# EAGLE design hexa2wide (EAGLE 7.2.0)
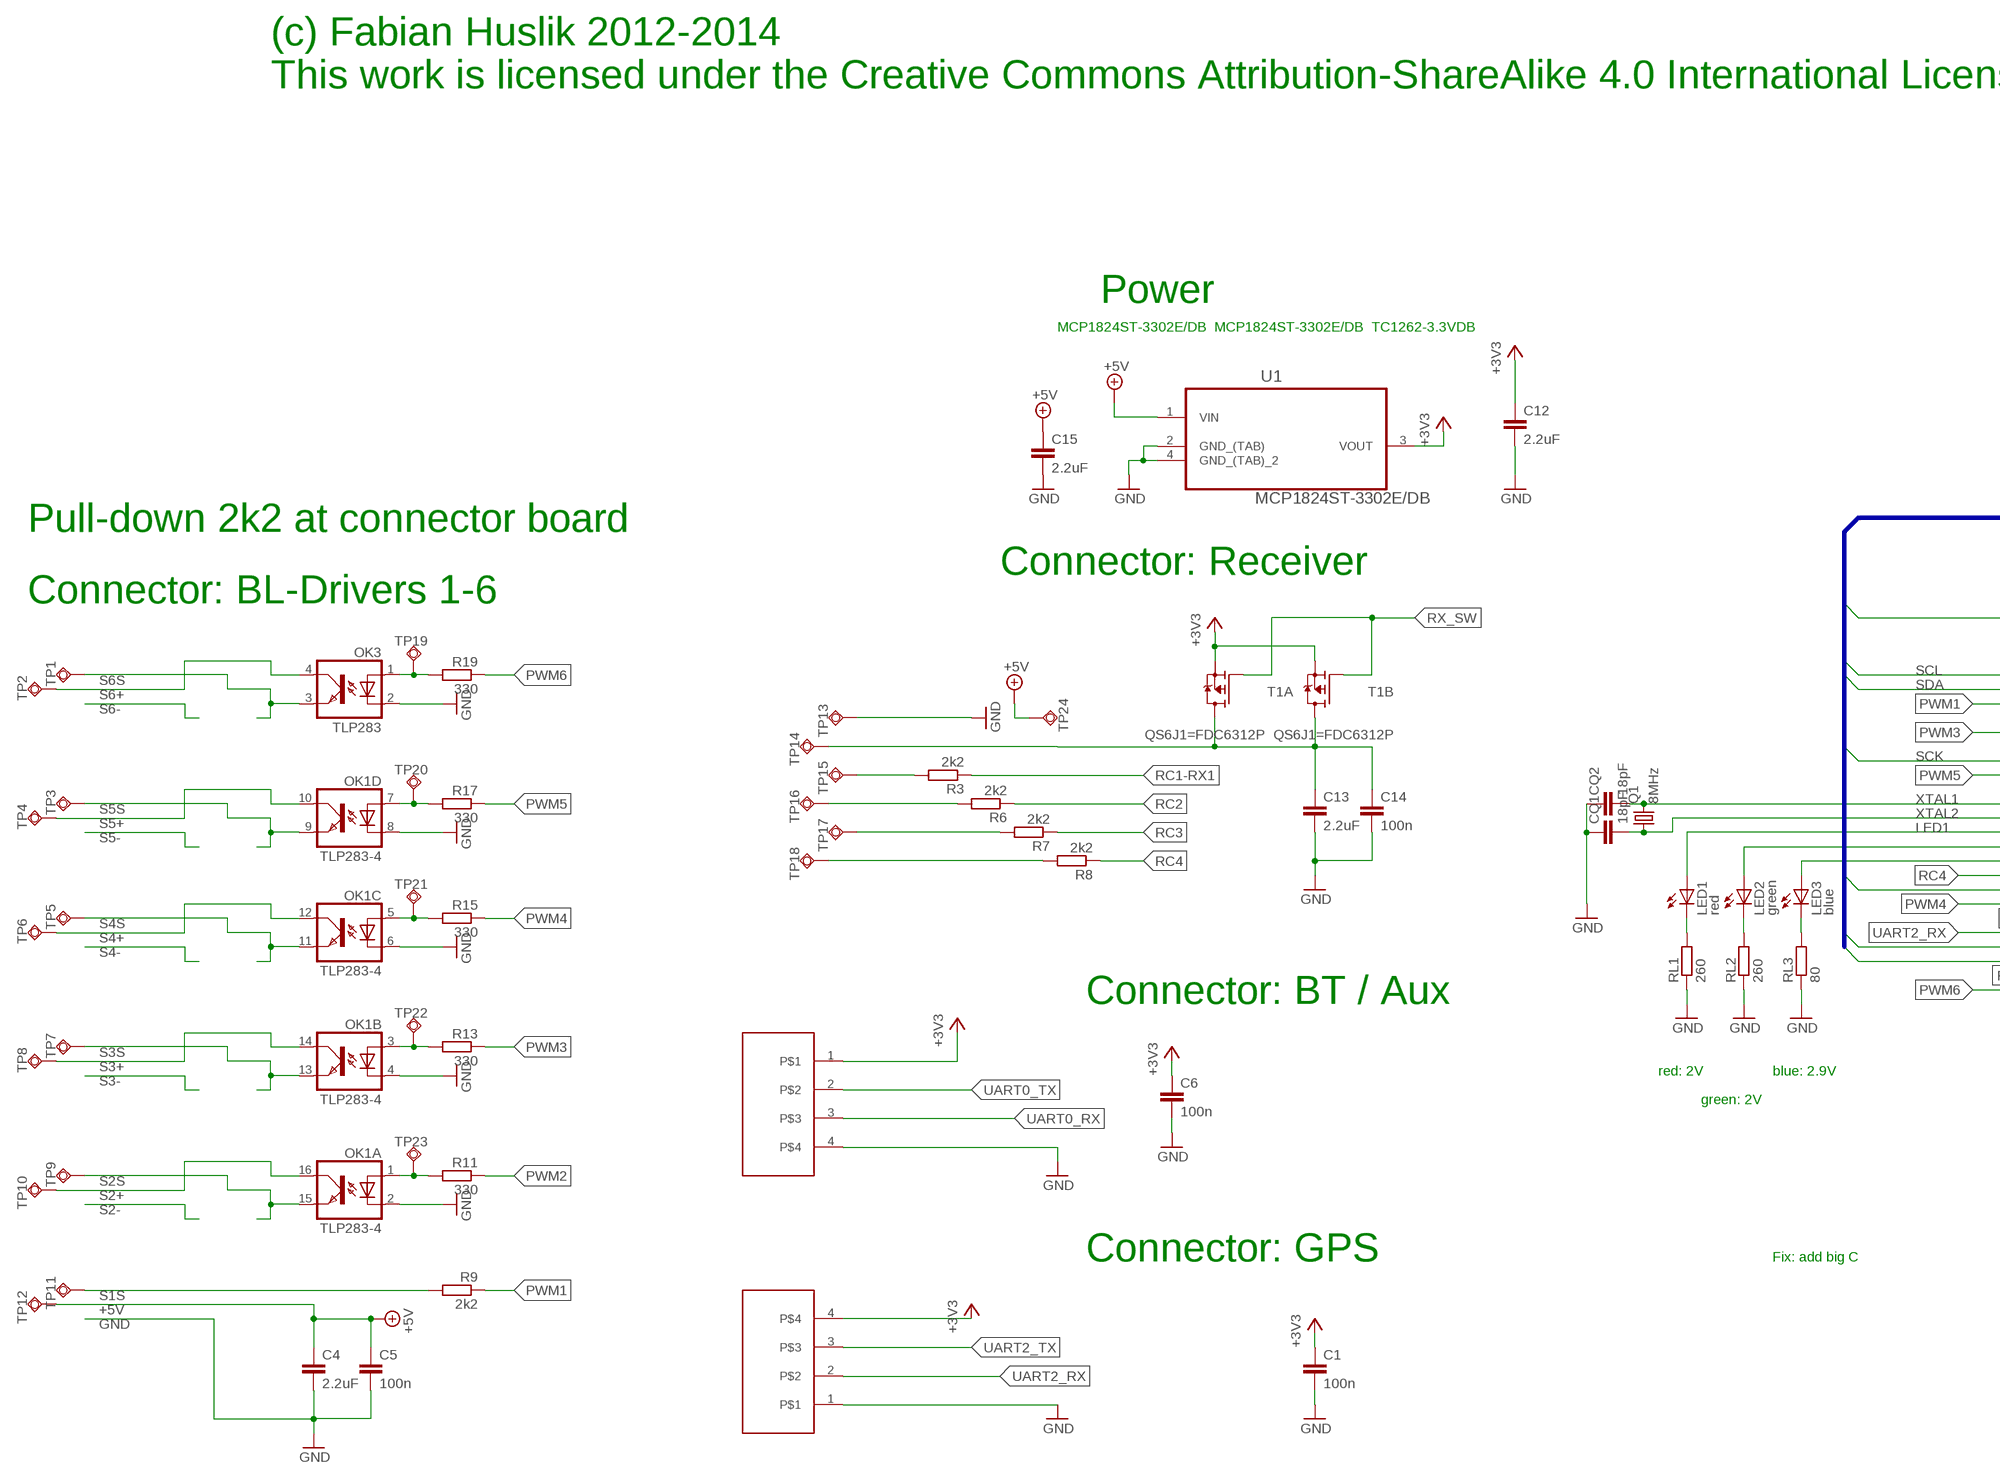
[diagram p0: schematic, sheet 1, part 1 of 2]
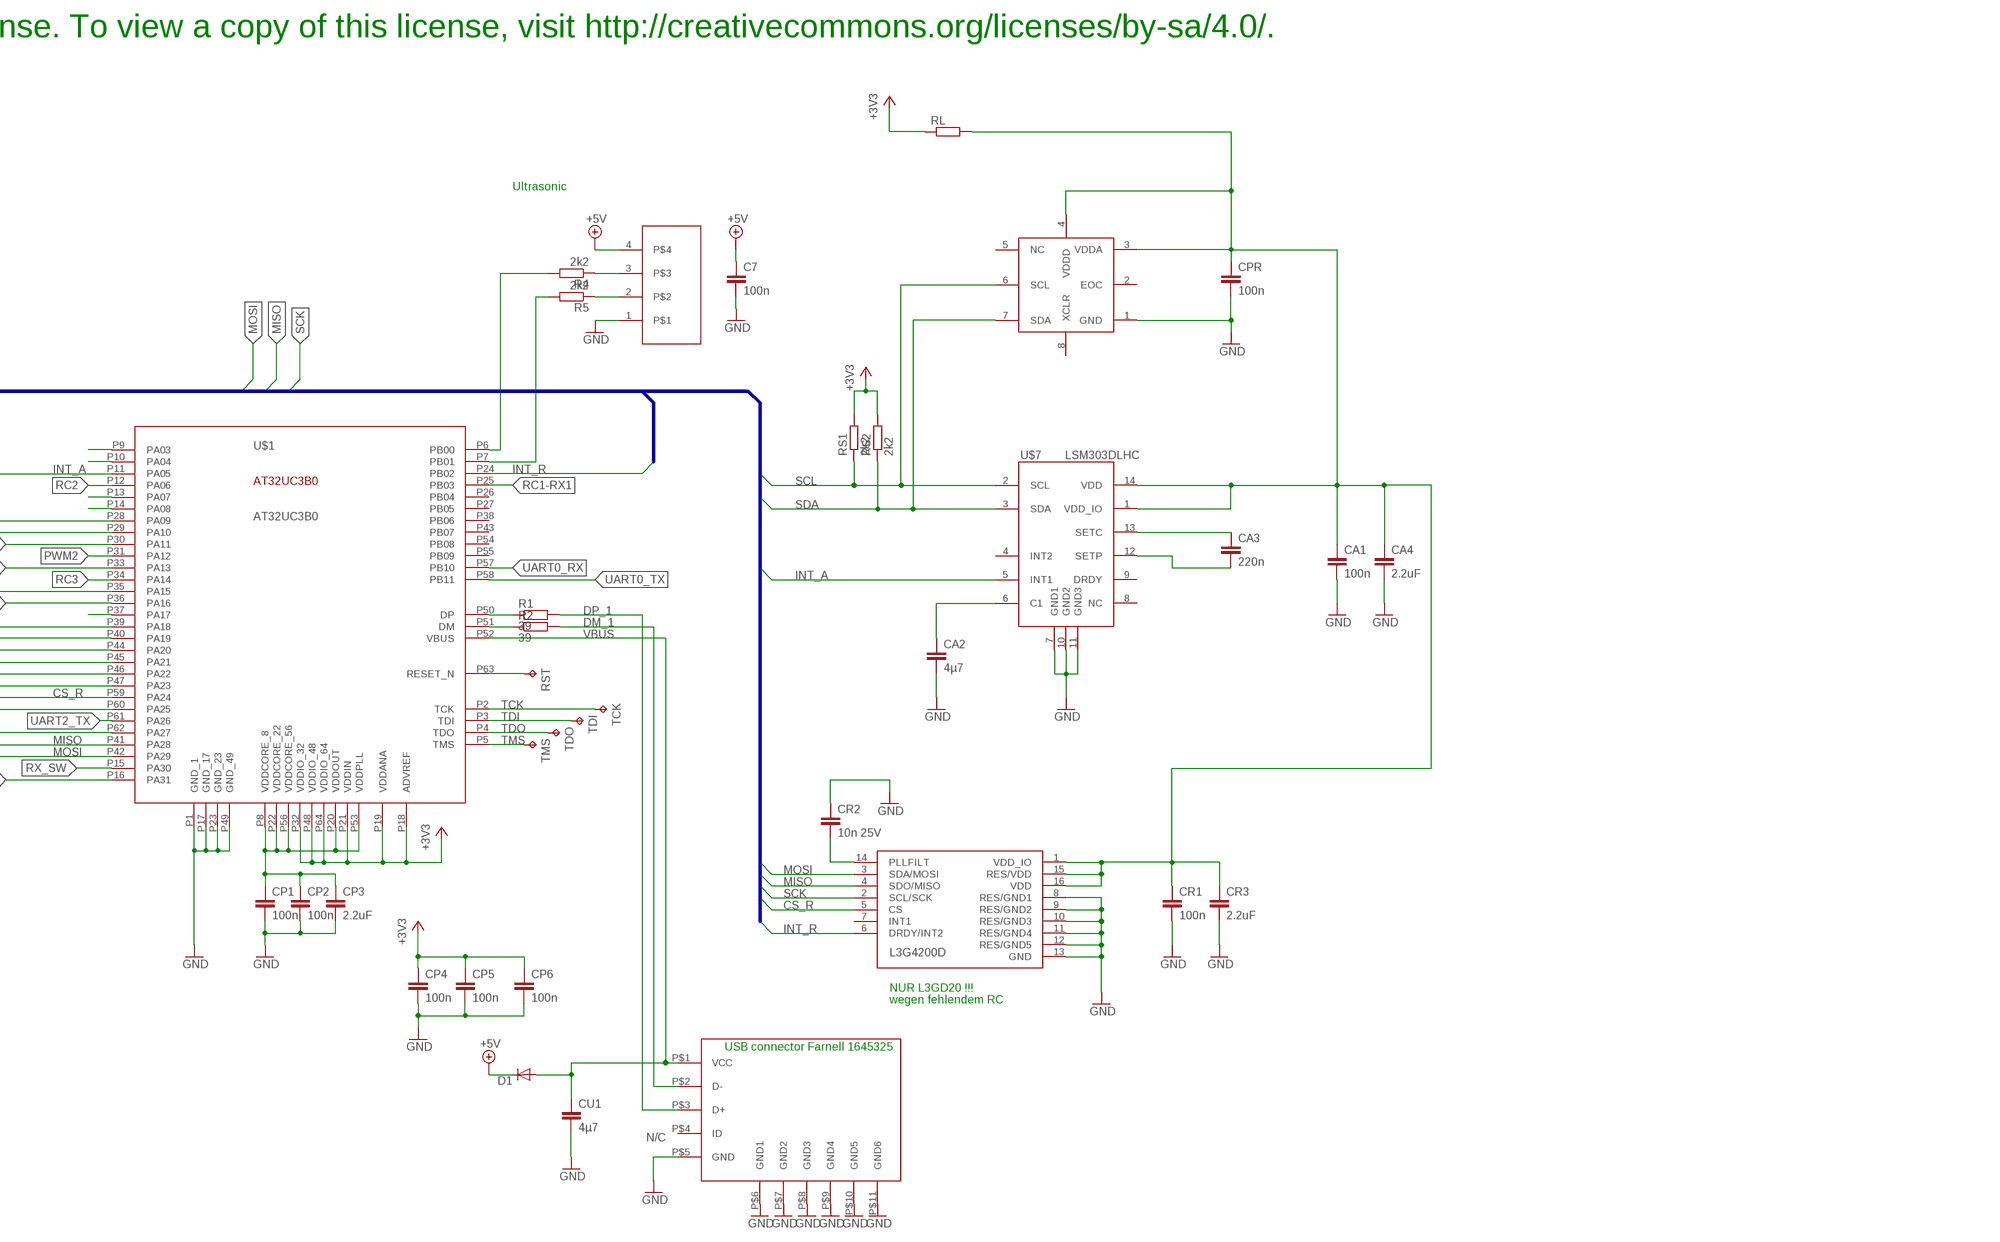
[diagram p1: schematic, sheet 1, part 2 of 2]

## Parts
C1  100n  C-EUC0402  [C0402]
C4  2.2uF  C-EUC0603K  [C0603K]
C5  100n  C-EUC0402  [C0402]
C6  100n  C-EUC0402  [C0402]
C7  100n  C-EUC0402  [C0402]
C12  2.2uF  C-EUC0603K  [C0603K]
C13  2.2uF  C-EUC0603K  [C0603K]
C14  100n  C-EUC0402  [C0402]
C15  2.2uF  C-EUC0603K  [C0603K]
CA1  100n  C-EUC0402  [C0402]
CA2  4µ7  C-EUC0805  [C0805]
CA3  220n  C-EUC0402  [C0402]
CA4  2.2uF  C-EUC0603K  [C0603K]
CP1  100n  C-EUC0402  [C0402]
CP2  100n  C-EUC0402  [C0402]
CP3  2.2uF  C-EUC0603K  [C0603K]
CP4  100n  C-EUC0402  [C0402]
CP5  100n  C-EUC0402  [C0402]
CP6  100n  C-EUC0402  [C0402]
CPR  100n  C-EUC0402  [C0402]
CQ1  18pF  C-EUC0402  [C0402]
CQ2  18pF  C-EUC0402  [C0402]
CR1  100n  C-EUC0402  [C0402]
CR2  10n 25V  C-EUC0402  [C0402]
CR3  2.2uF  C-EUC0603K  [C0603K]
CU1  4µ7  C-EUC0805  [C0805]
D1  DIODE-MICROMELF-R  [MICROMELF-R]
LED1  red  LEDCHIP-LED0603  [CHIP-LED0603]
LED2  green  LEDCHIP-LED0603  [CHIP-LED0603]
LED3  blue  LEDCHIP-LED0603  [CHIP-LED0603]
OK1  TLP283-4  [MINI-FLAT-16]
OK3  TLP283  [MINI-FLAT-4]
Q1  8MHz  CRYSTALCTS406  [CTS406]
R1  39  R-EU_R0402  [R0402]
R2  39  R-EU_R0402  [R0402]
R3  2k2  R-EU_R0402  [R0402]
R4  2k2  R-EU_R0402  [R0402]
R5  2k2  R-EU_R0402  [R0402]
R6  2k2  R-EU_R0402  [R0402]
R7  2k2  R-EU_R0402  [R0402]
R8  2k2  R-EU_R0402  [R0402]
R9  2k2  R-EU_R0402  [R0402]
R11  330  R-EU_R0402  [R0402]
R13  330  R-EU_R0402  [R0402]
R15  330  R-EU_R0402  [R0402]
R17  330  R-EU_R0402  [R0402]
R19  330  R-EU_R0402  [R0402]
RL  R-EU_R0603  [R0603]
RL1  260  R-EU_R0402  [R0402]
RL2  260  R-EU_R0402  [R0402]
RL3  80  R-EU_R0402  [R0402]
RS1  2k2  R-EU_R0402  [R0402]
RS2  2k2  R-EU_R0402  [R0402]
RST  TPB1,27  [B1,27]
T1  QS6J1=FDC6312P  [SUPERSOT-6]
TCK  TPB1,27  [B1,27]
TDI  TPB1,27  [B1,27]
TDO  TPB1,27  [B1,27]
TMS  TPB1,27  [B1,27]
TP1  TPSQTP16SQ  [TP16SQ]
TP2  TPSQTP16SQ  [TP16SQ]
TP3  TPSQTP16SQ  [TP16SQ]
TP4  TPSQTP16SQ  [TP16SQ]
TP5  TPSQTP16SQ  [TP16SQ]
TP6  TPSQTP16SQ  [TP16SQ]
TP7  TPSQTP16SQ  [TP16SQ]
TP8  TPSQTP16SQ  [TP16SQ]
TP9  TPSQTP16SQ  [TP16SQ]
TP10  TPSQTP16SQ  [TP16SQ]
TP11  TPSQTP16SQ  [TP16SQ]
TP12  TPSQTP16SQ  [TP16SQ]
TP13  TPSQTP16SQ  [TP16SQ]
TP14  TPSQTP16SQ  [TP16SQ]
TP15  TPSQTP16SQ  [TP16SQ]
TP16  TPSQTP16SQ  [TP16SQ]
TP17  TPSQTP16SQ  [TP16SQ]
TP18  TPSQTP16SQ  [TP16SQ]
TP19  TPSQTP10SQ  [TP10SQ]
TP20  TPSQTP10SQ  [TP10SQ]
TP21  TPSQTP10SQ  [TP10SQ]
TP22  TPSQTP10SQ  [TP10SQ]
TP23  TPSQTP10SQ  [TP10SQ]
TP24  TPSQTP10SQ  [TP10SQ]
U1  MCP1824ST-3302E/DB  [SOT230P700X180-4N]
U$1  AT32UC3B0  [JEDEC_MS-026]
U$4  UBB_MICRO_HIROSE  [USB_MICRO]
U$5  L3G4200DHAND  [LGA16_HAND]
U$7  LSM303HAND  [LGA14_HAND]
U$9  BMP085  [BMP085]
U$10  4WIRE_CONN  [4WIRE_PIN]
U$11  4WIRE_CONN  [4WIRE_PIN]
U$12  4WIRE_CONN  [4WIRE_PIN]

## Nets
1V6: CP1.1 CP2.1 CP3.1 U$1.P8(VDDCORE_8) U$1.P20(VDDOUT) U$1.P22(VDDCORE_22) U$1.P53(VDDPLL) U$1.P56(VDDCORE_56)
+3V3 [power]: C1.1 C6.1 C12.1 CP4.1 CP5.1 CP6.1 RL.1 RS1.2 RS2.2 T1.P$2(B:S) T1.P$5(A:S) U1.3(VOUT) U$1.P18(ADVREF) U$1.P19(VDDANA) U$1.P21(VDDIN) U$1.P32(VDDIO_32) U$1.P48(VDDIO_48) U$1.P64(VDDIO_64) U$10.4 U$11.1
+5V [power]: C4.1 C5.1 C7.1 C15.1 D1.C TP12.TP TP24.TP U1.1(VIN) U$12.4
CS_R: U$1.P59(PA24) U$5.5(CS)
DM: R2.1 U$1.P51(DM)
DM_1: R2.2 U$4.P$2(D-)
DP: R1.1 U$1.P50(DP)
DP_1: R1.2 U$4.P$3(D+)
GND [power]: C1.2 C4.2 C5.2 C6.2 C7.2 C12.2 C13.2 C14.2 C15.2 CA1.2 CA2.2 CA4.2 CP1.2 CP2.2 CP3.2 CP4.2 CP5.2 CP6.2 CPR.2 CQ1.1 CQ2.1 CR1.2 CR2.1 CR3.2 CU1.2 OK1.2(A:C) OK1.4(B:C) OK1.6(C:C) OK1.8(D:C) OK3.2(C) RL1.1 RL2.1 RL3.1 TP13.TP U1.2(GND_(TAB)) U1.4(GND_(TAB)_2) U$1.P1(GND_1) U$1.P17(GND_17) U$1.P23(GND_23) U$1.P49(GND_49) U$4.P$5(GND) U$4.P$6(GND1) U$4.P$7(GND2) U$4.P$8(GND3) U$4.P$9(GND4) U$4.P$10(GND5) U$4.P$11(GND6) U$5.8(RES/GND1) U$5.9(RES/GND2) U$5.10(RES/GND3) U$5.11(RES/GND4) U$5.12(RES/GND5) U$5.13(GND) U$7.7(GND1) U$7.10(GND2) U$7.11(GND3) U$9.1(GND) U$10.1 U$11.4 U$12.1
INT_A: U$1.P11(PA05) U$7.5(INT1)
INT_R: U$1.P24(PB02) U$5.6(DRDY/INT2)
LED1: LED1.A U$1.P44(PA20)
MISO: U$1.P41(PA28) U$5.4(SDO/MISO)
MOSI: U$1.P42(PA29) U$5.3(SDA/MOSI)
N$1: LED1.C RL1.2
N$2: RST.TP U$1.P63(RESET_N)
N$3: CA3.1 U$7.13(SETC)
N$4: LED2.C RL2.2
N$5: LED3.C RL3.2
N$6: LED2.A U$1.P45(PA21)
N$7: LED3.A U$1.P46(PA22)
N$8: CR2.2 U$5.14(PLLFILT)
N$9: U$1.P9(PA03)
N$10: CA2.1 U$7.6(C1)
N$11: CA3.2 U$7.12(SETP)
N$12: R3.2 TP15.TP
N$13 [power]: C13.1 C14.1 T1.P$4(B:D) T1.P$6(A:D) TP14.TP
N$14: R6.2 TP16.TP
N$15: R7.2 TP17.TP
N$16: R8.2 TP18.TP
N$17: U$1.P10(PA04)
N$18: OK1.1(A:A) R11.2 TP23.TP
N$19: OK1.3(B:A) R13.2 TP22.TP
N$20: U$1.P13(PA07)
N$21: U$1.P14(PA08)
N$22: OK1.5(C:A) R15.2 TP21.TP
N$23: R4.1 U$12.3
N$24: U$1.P37(PA17)
N$25: R5.1 U$12.2
N$26: OK1.7(D:A) R17.2 TP20.TP
N$30: OK3.1(A) R19.2 TP19.TP
PWM1: R9.1 U$1.P30(PA11)
PWM2: R11.1 U$1.P31(PA12)
PWM3: R13.1 U$1.P33(PA13)
PWM4: R15.1 U$1.P60(PA25)
PWM5: R17.1 U$1.P36(PA16)
PWM6: R19.1 U$1.P16(PA31)
RC1-RX1: R3.1 U$1.P25(PB03)
RC2: R6.1 U$1.P12(PA06)
RC3: R7.1 U$1.P34(PA14)
RC4: R8.1 U$1.P47(PA23)
RX_SW: T1.P$1(A:G) T1.P$3(B:G) U$1.P15(PA30)
S1S: R9.2 TP11.TP
S2+: OK1.16(A:COL) TP10.TP
S2S: OK1.15(A:EMIT) TP9.TP
S3+: OK1.14(B:COL) TP8.TP
S3S: OK1.13(B:EMIT) TP7.TP
S4+: OK1.12(C:COL) TP6.TP
S4S: OK1.11(C:EMIT) TP5.TP
S5+: OK1.10(D:COL) TP4.TP
S5S: OK1.9(D:EMIT) TP3.TP
S6+: OK3.4(COL) TP2.TP
S6S: OK3.3(EMIT) TP1.TP
SCK: U$1.P35(PA15) U$5.2(SCL/SCK)
SCL: RS1.1 U$1.P28(PA09) U$7.2(SCL) U$9.6(SCL)
SDA: RS2.1 U$1.P29(PA10) U$7.3(SDA) U$9.7(SDA)
TCA0: R4.2 U$1.P6(PB00)
TCB0: R5.2 U$1.P7(PB01)
TCK: TCK.TP U$1.P2(TCK)
TDI: TDI.TP U$1.P3(TDI)
TDO: TDO.TP U$1.P4(TDO)
TMS: TMS.TP U$1.P5(TMS)
UART0_RX: U$1.P57(PB10) U$11.3
UART0_TX: U$1.P58(PB11) U$11.2
UART2_RX: U$1.P62(PA27) U$10.2
UART2_TX: U$1.P61(PA26) U$10.3
VBUS: CU1.1 D1.A U$1.P52(VBUS) U$4.P$1(VCC)
VCCSENS [power]: CA1.1 CA4.1 CPR.1 CR1.1 CR3.1 RL.2 U$5.1(VDD_IO) U$5.15(RES/VDD) U$5.16(VDD) U$7.1(VDD_IO) U$7.14(VDD) U$9.3(VDDA) U$9.4(VDDD)
XTAL1: CQ2.2 Q1.3 U$1.P39(PA18)
XTAL2: CQ1.2 Q1.1 U$1.P40(PA19)
Unconnected: U$1.P26(PB04) U$1.P27(PB05) U$1.P38(PB06) U$1.P43(PB07) U$1.P54(PB08) U$1.P55(PB09) U$4.P$4(ID) U$5.7(INT1) U$7.4(INT2) U$7.8(NC) U$7.9(DRDY) U$9.2(EOC) U$9.5(NC) U$9.8(XCLR)

## Buses
MOSI,MISO,SCK,CS_R,INT_R,INT_A,SCL,SDA

## Notes on the sheet
- (c) Fabian Huslik 2012-2014
- This work is licensed under the Creative Commons Attribution-ShareAlike 4.0 International License. To view a copy of this license, visit http://creativecommons.org/licenses/by-sa/4.0/.
- Ultrasonic
- Power
- MCP1824ST-3302E/DB  MCP1824ST-3302E/DB  TC1262-3.3VDB
- Pull-down 2k2 at connector board
- Connector: Receiver
- Connector: BL-Drivers 1-6
- Connector: BT / Aux
- red: 2V | blue: 2.9V
- green: 2V
- NUR L3GD20 !!!
- Connector: GPS | Fix: add big C | wegen fehlendem RC
- USB connector Farnell 1645325
- N/C

## Library data of the parts
C1 C5-C7 C14 CA1 CP1 CP2 CP4-CP6 CPR CR1 = rcl:C-EU: CAPACITOR, European symbol; MF: MULTICOMP; MPN: MCCA000050; OC_FARNELL: 1758896
C4 C12 C13 C15 CA4 CP3 CR3 = rcl:C-EU: CAPACITOR, European symbol; MF: MURATA; MPN: GRM188R61C225KE15D; OC_FARNELL: 1735526
CA2 CU1 = rcl:C-EU: CAPACITOR, European symbol; MF: MURATA; MPN: GRM219R61C475KE15D; OC_FARNELL: 1845746
CA3 = rcl:C-EU: CAPACITOR, European symbol; MF: KEMET; MPN: C0402C224K9PACTU; OC_FARNELL: 1572610
CQ1 CQ2 = rcl:C-EU: CAPACITOR, European symbol; MF: KEMET; MPN: C0402C180J5GACTU; OC_FARNELL: 1572614RL
CR2 = rcl:C-EU: CAPACITOR, European symbol; MF: MULTICOMP; MPN: MCCA000076; OC_FARNELL: 1758924
D1 = diode:DIODE-: DIODE
LED1 = led:LED: LED OSRAM: - CHIPLED LG R971, LG N971, LY N971, LG Q971, LY Q971, LO R971, LY R971 LH N974, LH R974 LS Q976, LO Q976, LY Q976 LO Q996 - Hyper CHIPLED LW Q18S LB Q993, LB Q99A, LB R99A - SideLED LS A670, LO A670, LY A670, LG A670, LP A670 LB A673, LV A673, LT A673, LW A673 LH A674 LY A675 LS A676, LA A676, LO A676, LY A676, LW A676 LS A679, LY A679, LG A679 - Hyper Micro SIDELED® LS Y876, LA Y876, LO Y876, LY Y876 LT Y87S - SmartLED LW L88C, LW L88S LB L89C, LB L89S, LG L890 LS L89K, LO L89K, LY L89K LS L896, LA L896, LO L896, LY L896 - TOPLED LS T670, LO T670, LY T670, LG T670, LP T670 LSG T670, LSP T670, LSY T670, LOP T670, LYG T670 LG T671, LOG T671, LSG T671 LB T673, LV T673, LT T673, LW T673 LH T674 LS T676, LA T676, LO T676, LY T676, LB T676, LH T676, LSB T676, LW T676 LB T67C, LV T67C, LT T67C, LS T67K, LO T67K, LY T67K, LW E67C LS E67B, LA E67B, LO E67B, LY E67B, LB E67C, LV E67C, LT E67C LW T67C LS T679, LY T679, LG T679 LS T770, LO T770, LY T770, LG T770, LP T770 LB T773, LV T773, LT T773, LW T773 LH T774 LS E675, LA E675, LY E675, LS T675 LS T776, LA T776, LO T776, LY T776, LB T776 LHGB T686 LT T68C, LB T68C - Hyper Mini TOPLED® LB M676 - Mini TOPLED Santana® LG M470 LS M47K, LO M47K, LY M47K Source: http://www.osram.convergy.de LUXEON: - LUMILED® LXK2-PW12-R00, LXK2-PW12-S00, LXK2-PW14-U00, LXK2-PW14-V00 LXK2-PM12-R00, LXK2-PM12-S00, LXK2-PM14-U00 LXK2-PE12-Q00, LXK2-PE12-R00, LXK2-PE12-S00, LXK2-PE14-T00, LXK2-PE14-U00 LXK2-PB12-K00, LXK2-PB12-L00, LXK2-PB12-M00, LXK2-PB14-N00, LXK2-PB14-P00, LXK2-PB14-Q00 LXK2-PR12-L00, LXK2-PR12-M00, LXK2-PR14-Q00, LXK2-PR14-R00 LXK2-PD12-Q00, LXK2-PD12-R00, LXK2-PD12-S00 LXK2-PH12-R00, LXK2-PH12-S00 LXK2-PL12-P00, LXK2-PL12-Q00, LXK2-PL12-R00 Source: www.luxeon.com KINGBRIGHT: KA-3528ASYC Source: www.kingbright.com; MF: AVAGO TECHNOLOGIES; MPN: ASMT-RR45-AQ902; OC_FARNELL: 1652080
LED2 = led:LED: LED OSRAM: - CHIPLED LG R971, LG N971, LY N971, LG Q971, LY Q971, LO R971, LY R971 LH N974, LH R974 LS Q976, LO Q976, LY Q976 LO Q996 - Hyper CHIPLED LW Q18S LB Q993, LB Q99A, LB R99A - SideLED LS A670, LO A670, LY A670, LG A670, LP A670 LB A673, LV A673, LT A673, LW A673 LH A674 LY A675 LS A676, LA A676, LO A676, LY A676, LW A676 LS A679, LY A679, LG A679 - Hyper Micro SIDELED® LS Y876, LA Y876, LO Y876, LY Y876 LT Y87S - SmartLED LW L88C, LW L88S LB L89C, LB L89S, LG L890 LS L89K, LO L89K, LY L89K LS L896, LA L896, LO L896, LY L896 - TOPLED LS T670, LO T670, LY T670, LG T670, LP T670 LSG T670, LSP T670, LSY T670, LOP T670, LYG T670 LG T671, LOG T671, LSG T671 LB T673, LV T673, LT T673, LW T673 LH T674 LS T676, LA T676, LO T676, LY T676, LB T676, LH T676, LSB T676, LW T676 LB T67C, LV T67C, LT T67C, LS T67K, LO T67K, LY T67K, LW E67C LS E67B, LA E67B, LO E67B, LY E67B, LB E67C, LV E67C, LT E67C LW T67C LS T679, LY T679, LG T679 LS T770, LO T770, LY T770, LG T770, LP T770 LB T773, LV T773, LT T773, LW T773 LH T774 LS E675, LA E675, LY E675, LS T675 LS T776, LA T776, LO T776, LY T776, LB T776 LHGB T686 LT T68C, LB T68C - Hyper Mini TOPLED® LB M676 - Mini TOPLED Santana® LG M470 LS M47K, LO M47K, LY M47K Source: http://www.osram.convergy.de LUXEON: - LUMILED® LXK2-PW12-R00, LXK2-PW12-S00, LXK2-PW14-U00, LXK2-PW14-V00 LXK2-PM12-R00, LXK2-PM12-S00, LXK2-PM14-U00 LXK2-PE12-Q00, LXK2-PE12-R00, LXK2-PE12-S00, LXK2-PE14-T00, LXK2-PE14-U00 LXK2-PB12-K00, LXK2-PB12-L00, LXK2-PB12-M00, LXK2-PB14-N00, LXK2-PB14-P00, LXK2-PB14-Q00 LXK2-PR12-L00, LXK2-PR12-M00, LXK2-PR14-Q00, LXK2-PR14-R00 LXK2-PD12-Q00, LXK2-PD12-R00, LXK2-PD12-S00 LXK2-PH12-R00, LXK2-PH12-S00 LXK2-PL12-P00, LXK2-PL12-Q00, LXK2-PL12-R00 Source: www.luxeon.com KINGBRIGHT: KA-3528ASYC Source: www.kingbright.com; MF: AVAGO TECHNOLOGIES; MPN: ASMT-RF45-AN002; OC_FARNELL: 1652078
LED3 = led:LED: LED OSRAM: - CHIPLED LG R971, LG N971, LY N971, LG Q971, LY Q971, LO R971, LY R971 LH N974, LH R974 LS Q976, LO Q976, LY Q976 LO Q996 - Hyper CHIPLED LW Q18S LB Q993, LB Q99A, LB R99A - SideLED LS A670, LO A670, LY A670, LG A670, LP A670 LB A673, LV A673, LT A673, LW A673 LH A674 LY A675 LS A676, LA A676, LO A676, LY A676, LW A676 LS A679, LY A679, LG A679 - Hyper Micro SIDELED® LS Y876, LA Y876, LO Y876, LY Y876 LT Y87S - SmartLED LW L88C, LW L88S LB L89C, LB L89S, LG L890 LS L89K, LO L89K, LY L89K LS L896, LA L896, LO L896, LY L896 - TOPLED LS T670, LO T670, LY T670, LG T670, LP T670 LSG T670, LSP T670, LSY T670, LOP T670, LYG T670 LG T671, LOG T671, LSG T671 LB T673, LV T673, LT T673, LW T673 LH T674 LS T676, LA T676, LO T676, LY T676, LB T676, LH T676, LSB T676, LW T676 LB T67C, LV T67C, LT T67C, LS T67K, LO T67K, LY T67K, LW E67C LS E67B, LA E67B, LO E67B, LY E67B, LB E67C, LV E67C, LT E67C LW T67C LS T679, LY T679, LG T679 LS T770, LO T770, LY T770, LG T770, LP T770 LB T773, LV T773, LT T773, LW T773 LH T774 LS E675, LA E675, LY E675, LS T675 LS T776, LA T776, LO T776, LY T776, LB T776 LHGB T686 LT T68C, LB T68C - Hyper Mini TOPLED® LB M676 - Mini TOPLED Santana® LG M470 LS M47K, LO M47K, LY M47K Source: http://www.osram.convergy.de LUXEON: - LUMILED® LXK2-PW12-R00, LXK2-PW12-S00, LXK2-PW14-U00, LXK2-PW14-V00 LXK2-PM12-R00, LXK2-PM12-S00, LXK2-PM14-U00 LXK2-PE12-Q00, LXK2-PE12-R00, LXK2-PE12-S00, LXK2-PE14-T00, LXK2-PE14-U00 LXK2-PB12-K00, LXK2-PB12-L00, LXK2-PB12-M00, LXK2-PB14-N00, LXK2-PB14-P00, LXK2-PB14-Q00 LXK2-PR12-L00, LXK2-PR12-M00, LXK2-PR14-Q00, LXK2-PR14-R00 LXK2-PD12-Q00, LXK2-PD12-R00, LXK2-PD12-S00 LXK2-PH12-R00, LXK2-PH12-S00 LXK2-PL12-P00, LXK2-PL12-Q00, LXK2-PL12-R00 Source: www.luxeon.com KINGBRIGHT: KA-3528ASYC Source: www.kingbright.com; MF: ROHM; MPN: SMLE12BC7TT86Q; OC_FARNELL: 1685096
OK1 = optocoupler:TLP283-4: TOSHIBA PHOTOCOUPLER GaAs IRED & PHOTO-TRANSISTOR Source: http://www.semicon.toshiba.co.jp/td/en/Opto/Photocoupler/en_20050928_TLP283_datasheet.pdf; MF: AVAGO TECHNOLOGIES; MPN: ACPL-247-500E; OC_FARNELL: 1634758; OC_NEWARK: unknown
OK3 = optocoupler:TLP283: TOSHIBA PHOTOCOUPLER GaAs IRED & PHOTO-TRANSISTOR Source: http://www.semicon.toshiba.co.jp/td/en/Opto/Photocoupler/en_20050928_TLP283_datasheet.pdf; MF: AVAGO TECHNOLOGIES; MPN: ACPL-217-500E; OC_FARNELL: 1602614; OC_NEWARK: unknown
Q1 = crystal:CRYSTAL: CRYSTAL; MF: ABRACON; MPN: ABMM2-8.000MHZ-E2-T; OC_FARNELL: 1611803; OC_NEWARK: unknown
R1 R2 = rcl:R-EU_: RESISTOR, European symbol; MF: VISHAY DRALORIC; MPN: CRCW040239R0FKEAHP; OC_FARNELL: 1738831
R3-R9 RS1 RS2 = rcl:R-EU_: RESISTOR, European symbol; MF: VISHAY DRALORIC; MPN: CRCW040210K5FKED; OC_FARNELL: 2140861RL
R11 R13 R15 R17 R19 = rcl:R-EU_: RESISTOR, European symbol; MF: MULTICOMP; MPN: MCMR04X331 JTL; OC_FARNELL: 2072931
RL = rcl:R-EU_: RESISTOR, European symbol; MF: WURTH ELEKTRONIK; MPN: 74279266; OC_FARNELL: 1635693
RL1 RL2 = rcl:R-EU_: RESISTOR, European symbol; MF: VISHAY DRALORIC; MPN: CRCW0402604RFKED; OC_FARNELL: 2140752
RL3 = rcl:R-EU_: RESISTOR, European symbol; MF: PANASONIC; MPN: ERJ2RKF8062X; OC_FARNELL: 2059179
RST TCK TDI TDO TMS = testpad:TP: Test pad; OC_FARNELL: unknown
T1 = Fabian:QS6J1=FDC6312P: FDC6312P Dual P-Channel; BEST: Farnell 1525470 od 1700713; MF: FAIRCHILD SEMICONDUCTOR; MPN: FDC6312P; OC_FARNELL: 1700713
TP1-TP24 = testpad:TPSQ: Test pad; OC_FARNELL: unknown
U1 = Fabian:MCP1824ST-3302E/DB: IC, LDO VOLT REG, 3.3V, 0.3A,; MF: MICROCHIP; MPN: MCP1824ST-3302E/DB; OC_FARNELL: 1578379; OC_NEWARK: 05N1293; PACKAGE: SOT-223-3; SUPPLIER: Microchip
U$1 = UC3Bxxxx:AT32UC3B0: The AT32UC3B is a complete System-On-Chip microcontroller based on the AVR32 UC RISC processor running at frequencies up to 60 MHz. AVR32 UC is a high-performance 32-bit RISC microprocessor core, designed for cost-sensitive embedded applications, with particular empha- sis on low power consumption, high code density and high performance.; MF: ATMEL; MPN: AT32UC3B0256-A2UT; OC_FARNELL: 1715453
U$4 = Fabian:UBB_MICRO_HIROSE: HRS (HIROSE) - ZX62-B-5PA(11); MF: HRS (HIROSE); MPN: ZX62-B-5PA(11); OC_FARNELL: 1645325
U$5 = st-Gyro:L3G4200D; MF: STMICROELECTRONICS; MPN: L3GD20; OC_FARNELL: 2295818
U$7 = ST Accelometer:LSM303: The LSM303DLHC is a system-in-package featuring a 3D digital linear acceleration sensor and a 3D digital magnetic sensor. LSM303DLHC has a linear acceleration full scales of ±2g / ±4g / ±8g / ±16g and a magnetic field full-scale of ±1.3 / ±1.9 / ±2.5 / ±4.0 / ±4.7 / ±5.6 / ±8.1 gauss. All full-scales available are fully selectable by the user. LSM303DLHC include a I2C serial bus interface that support standard and fast mode 100kHz and 400kHz.; MF: STMICROELECTRONICS; MPN: LSM303DLHC; OC_FARNELL: 2068595
U$9 = SparkFun:BMP085; OC_FARNELL: unknown
U$10-U$12 = Fabian:4WIRE_CONN; OC_FARNELL: unknown

## Net classes
1 power: width 0.25 mm

## Board
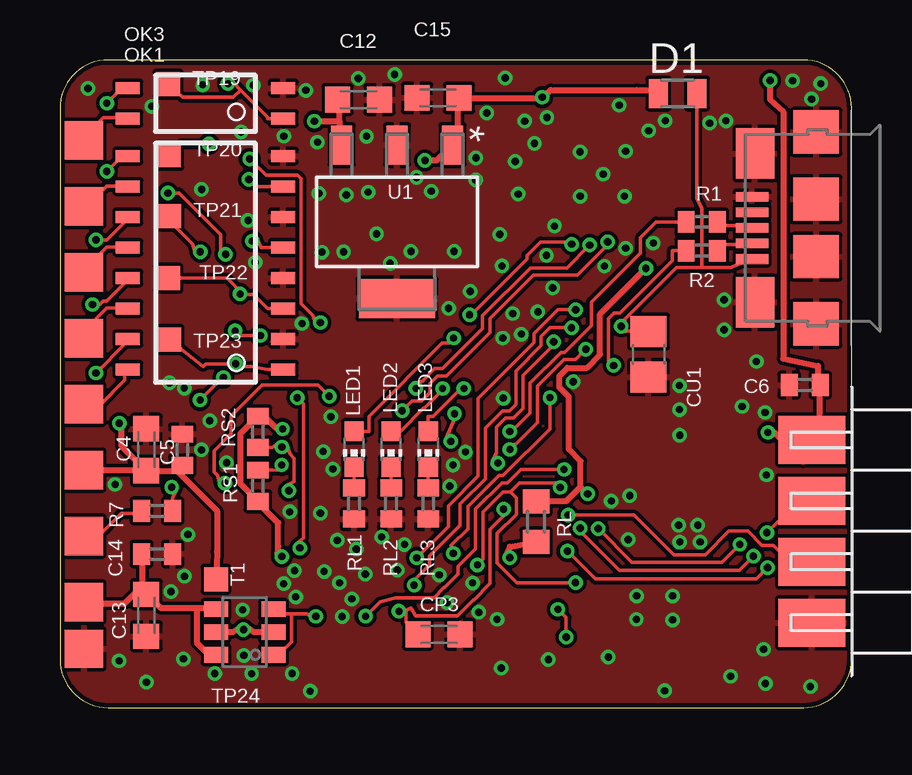
[diagram p2: board, top side]
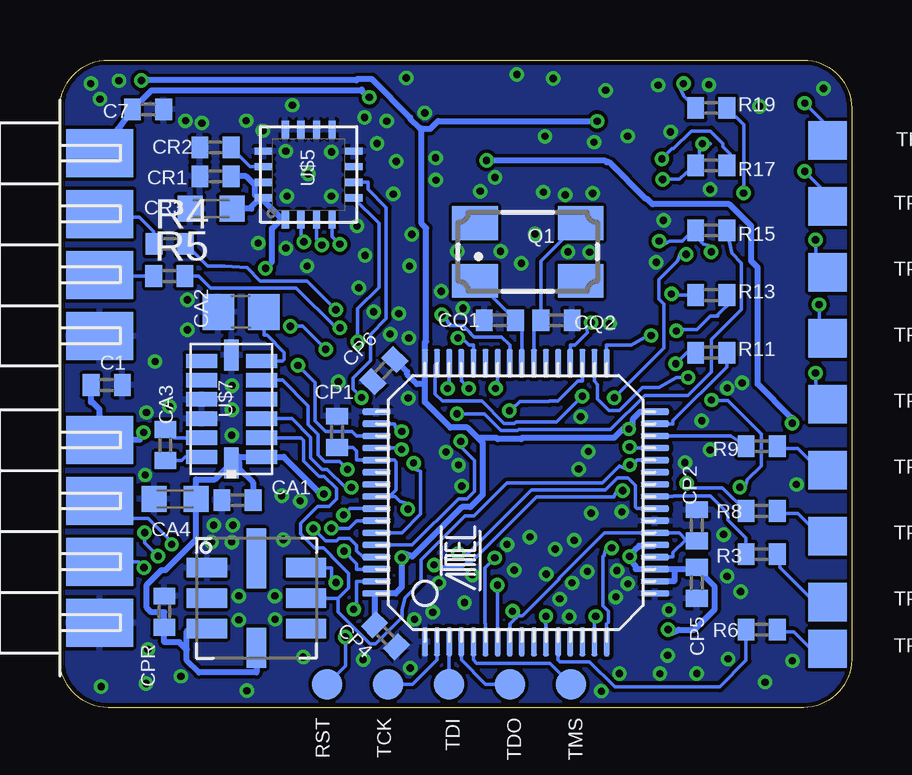
[diagram p3: board, bottom side, seen from below]

Size 33 x 27 mm. Coordinates in mm from the lower left corner, seen from the top.
Outline: 2,27 arc90 0,25 0,2 arc90 2,0 31,0 arc90 33,2 33,25 arc90 31,27 2,27
Copper layers (1*16): Top 0.035mm / dielectric 1.5mm / Bottom 0.035mm
Design rules "Fischer-LP_BGA": minimum track width 0.15mm, minimum drill 0.3mm, track to track 0.15mm, track to pad 0.15mm, pad to pad 0.15mm, via to via 0.15mm, smd to smd 0mil, copper to edge 0.2mm, drill to drill 0.3mm, minimum pad ring 0.2mm, minimum via ring 0.15mm, stop-mask expansion 0.05mm, vias tented up to drill 0.5mm, thermal gap 0.15mm

### Footprints (pad centres in the part's own frame; a part is rotated, then mirrored left to right if it is on the bottom)
C0402 = smd 0.7 x 0.9: 1 -0.65,0; 2 0.65,0
C0603K = smd 1.05 x 1.08: 1 -0.875,0; 2 0.875,0
C0805 = smd 1.3 x 1.5: 1 -0.95,0; 2 0.95,0
MICROMELF-R = smd 0.8 x 1.2: A 0.8,0; C -0.8,0
CHIP-LED0603 = smd 0.8 x 0.8: A 0,-0.75; C 0,0.75
MINI-FLAT-16 = smd 1 x 0.5: 1 -3.24,4.445; 2 -3.24,3.175; 3 -3.24,1.905; 4 -3.24,0.635; 5 -3.24,-0.635; 6 -3.24,-1.905; 7 -3.24,-3.175; 8 -3.24,-4.445; 9 3.24,-4.445; 10 3.24,-3.175; 11 3.24,-1.905; 12 3.24,-0.635; 13 3.24,0.635; 14 3.24,1.905; 15 3.24,3.175; 16 3.24,4.445
MINI-FLAT-4 = smd 1 x 0.5: 1 -3.24,0.635; 2 -3.24,-0.635; 3 3.24,-0.635; 4 3.24,0.635
CTS406 = smd 1.9 x 1.4: 1 -2.2,-1.2; 2 2.2,-1.2; 3 2.2,1.2; 4 -2.2,1.2
R0402 = smd 0.7 x 0.9: 1 -0.65,0; 2 0.65,0
R0603 = smd 1 x 1.1: 1 -0.85,0; 2 0.85,0
B1,27 = smd 1.27 x 1.27: TP 0,0
SUPERSOT-6 = smd 0.65 x 1: P$1 -0.95,-1.2; P$2 0,-1.2; P$3 0.95,-1.2; P$4 0.95,1.2; P$5 0,1.2; P$6 -0.95,1.2
TP16SQ = smd 1.6 x 1.6: TP 0,0
TP10SQ = smd 1 x 1: TP 0,0
SOT230P700X180-4N = smd 1.626 x 0.889: 1 -3.2,2.311; 2 -3.2,0; 3 -3.2,-2.311 | smd 1.626 x 3.175: 4 3.2,0
JEDEC_MS-026 = smd 1.2 x 0.27: P1 -6.06,3.535; P2 -6.06,3.03; P3 -6.06,2.525; P4 -6.06,2.02; P5 -6.06,1.515; P6 -6.06,1.01; P7 -6.06,0.505; P8 -6.06,0; P9 -6.06,-0.505; P10 -6.06,-1.01; P11 -6.06,-1.515; P12 -6.06,-2.02; P13 -6.06,-2.525; P14 -6.06,-3.03; P15 -6.06,-3.535; P16 -6.06,-4.04; P33 5.555,-4.04; P34 5.555,-3.535; P35 5.555,-3.03; P36 5.555,-2.525; P37 5.555,-2.02; P38 5.555,-1.515; P39 5.555,-1.01; P40 5.555,-0.505; P41 5.555,0; P42 5.555,0.505; P43 5.555,1.01; P44 5.555,1.515; P45 5.555,2.02; P46 5.555,2.525; P47 5.555,3.03; P48 5.555,3.535 | smd 0.27 x 1.2: P17 -4.04,-6.06; P18 -3.535,-6.06; P19 -3.03,-6.06; P20 -2.525,-6.06; P21 -2.02,-6.06; P22 -1.515,-6.06; P23 -1.01,-6.06; P24 -0.505,-6.06; P25 0,-6.06; P26 0.505,-6.06; P27 1.01,-6.06; P28 1.515,-6.06; P29 2.02,-6.06; P30 2.525,-6.06; P31 3.03,-6.06; P32 3.535,-6.06; P49 3.535,5.555; P50 3.03,5.555; P51 2.525,5.555; P52 2.02,5.555; P53 1.515,5.555; P54 1.01,5.555; P55 0.505,5.555; P56 0,5.555; P57 -0.505,5.555; P58 -1.01,5.555; P59 -1.515,5.555; P60 -2.02,5.555; P61 -2.525,5.555; P62 -3.03,5.555; P63 -3.535,5.555; P64 -4.04,5.555
USB_MICRO = smd 0.4 x 1.35: P$1 3.6,4.125; P$2 4.25,4.125; P$3 4.9,4.125; P$4 5.55,4.125; P$5 6.2,4.125 | smd 1.8 x 1.9: P$6 0.9,1.45; P$7 3.7,1.45; P$8 6.1,1.45; P$9 8.9,1.45 | smd 2.1 x 1.6: P$10 1.8,4; P$11 8,4
LGA16_HAND = smd 0.75 x 0.3: 1 0.125,2.975; 2 0.125,2.325; 3 0.125,1.675; 4 0.125,1.025; 9 3.875,1.025; 10 3.875,1.675; 11 3.875,2.325; 12 3.875,2.975 | smd 0.3 x 0.75: 5 1.025,0.125; 6 1.675,0.125; 7 2.325,0.125; 8 2.975,0.125; 13 2.975,3.875; 14 2.325,3.875; 15 1.675,3.875; 16 1.025,3.875
LGA14_HAND = smd 1.3 x 0.6: 1 -1.25,1.4; 2 -1.25,0.6; 3 -1.25,-0.2; 4 -1.25,-1; 5 -1.25,-1.8; 6 -1.25,-2.6; 8 1.25,-2.6; 9 1.25,-1.8; 10 1.25,-1; 11 1.25,-0.2; 12 1.25,0.6; 13 1.25,1.4 | smd 0.6 x 1.3: 7 0,-2.85; 14 0,1.65
BMP085 = smd 1.67 x 0.8: 1 -2.065,1.27; 2 -2.065,0; 3 -2.065,-1.27; 5 2.065,-1.27; 6 2.065,0; 7 2.065,1.27 | smd 0.8 x 1.67: 4 0,-2.065 | smd 0.8 x 2.5: 8 0,1.65
4WIRE_PIN = smd 2 x 2.8: 1 -2.54,0.254; 2 0,0.254; 3 2.54,0.254; 4 5.08,0.254

### Placement (x,y rotation side)
C1  31.05,13.45 0 bottom
C4  3.6,10.75 90 top
C5  5.1,10.75 90 top
C6  31.05,13.45 180 top
C7  29.33,24.94 0 bottom
C12  12.45,25.35 0 top
C13  3.6,3.85 270 top
C14  4.05,6.4 0 top
C15  15.76,25.42 180 top
CA1  25.6,8.65 180 bottom
CA2  25.45,16.5 180 bottom
CA3  28.6,10.95 90 bottom
CA4  28.2,8.7 180 bottom
CP1  21.45,11.5 90 bottom
CP2  6.45,7.6 90 bottom
CP3  15.8,3.06 0 top
CP4  19.43,2.99 315 bottom
CP5  6.45,5.2 270 bottom
CP6  19.5,14.05 225 bottom
CPR  28.65,4 90 bottom
CQ1  14.66,16.15 0 bottom
CQ2  12.3,16.15 180 bottom
CR1  26.52,22.15 180 bottom
CR2  26.52,23.35 0 bottom
CR3  26.7,20.8 180 bottom
CU1  24.54,14.73 270 top
D1  25.75,25.6 0 top
LED1  12.26,10.77 180 top
LED2  13.8,10.77 180 top
LED3  15.35,10.77 180 top
OK1  6.07,18.55 180 top
OK3  6.07,25.2 180 top
Q1  13.5,19 0 bottom
R1  26.75,20.25 0 top
R2  26.75,19.05 0 top
R3  3.75,6.4 0 bottom
R4  28.42,19.33 0 bottom
R5  28.44,17.99 0 bottom
R6  3.75,3.25 0 bottom
R7  4.05,8.2 180 top
R8  3.75,8.2 0 bottom
R9  3.75,10.9 0 bottom
R11  5.85,14.8 180 bottom
R13  5.85,17.2 180 bottom
R15  5.85,19.9 180 bottom
R17  5.85,22.6 180 bottom
R19  5.85,25 180 bottom
RL  19.85,7.75 90 top
RL1  12.26,8.51 90 top
RL2  13.8,8.51 90 top
RL3  15.35,8.51 90 top
RS1  8.25,9.25 270 top
RS2  8.25,11.5 90 top
RST  21.86,0.97 90 bottom
T1  7.7,3.15 90 top
TCK  19.32,0.97 90 bottom
TDI  16.77,0.97 90 bottom
TDO  14.23,0.97 90 bottom
TMS  11.7,0.97 90 bottom
TP1  1,23.65 0 bottom
TP2  1,23.65 0 top
TP3  1,20.9 0 bottom
TP4  1,20.9 0 top
TP5  1,18.15 0 bottom
TP6  1,18.15 0 top
TP7  1,15.4 0 bottom
TP8  1,15.4 0 top
TP9  1,12.65 0 bottom
TP10  1,12.65 0 top
TP11  1,9.9 0 bottom
TP12  1,9.9 0 top
TP13  1,2.45 0 top
TP14  1,4.4 0 top
TP15  1,4.4 0 bottom
TP16  1,2.45 0 bottom
TP17  1,7.15 0 top
TP18  1,7.15 0 bottom
TP19  4.5,26 0 top
TP20  4.54,23.03 0 top
TP21  4.55,20.5 0 top
TP22  4.5,17.9 0 top
TP23  4.55,15.35 0 top
TP24  6.5,5.35 0 top
U1  14.05,20.25 270 top
U$1  14.25,8.8 90 bottom
U$4  32.98,15.1 90 top
U$5  20.63,20.23 90 bottom
U$7  25.85,11.85 180 bottom
U$9  24.81,4.56 0 bottom
U$10  31.09,6.08 90 bottom
U$11  31.09,8.62 270 top
U$12  31.09,18.04 90 bottom

### Tracks (layer width: path | path; a pad name or v marks a point on that pad's centre or on a via)
1V6  (via drill 0.3 pad 0.6)
  Top 0.15: v14.13,4.02 14.16,4.05 14.42,4.05 | 14.42,4.05 14.42,3.56 CP3.1 | 14.42,4.05 14.44,4.05 14.63,4.16 14.83,3.83 16.57,3.83 17.24,4.5 17.26,4.5 17.93,5.17 17.93,7.43 18.55,8.05 v18.5,8.27
  Bottom 0.15: CP1.1 20.77,10.85 20.63,10.71 20.63,10.31 U$1.P53 19.05,10.31 18.98,10.24 18.98,9.08 19.26,8.8 | 13.94,3.83 v14.13,4.02 | v14.13,4.02 | 13.94,3.83 13.72,3.83 12.2,5.35 12.2,5.39 10.31,7.29 U$1.P22 7.18,7.29 6.9,7 | 13.94,3.83 14.02,3.72 14.25,3.49 U$1.P8 | v18.5,8.27 18.44,8.49 18.81,8.59 19.02,8.8 19.26,8.8 | 19.26,8.8 U$1.P56 | 6.9,7 7.44,6.46 7.44,6.28 U$1.P20 | CP2.1 6.5,7 6.9,7
+3V3  (via drill 0.3 pad 0.6)
  Top 0.25: v18.75,6.25 18.59,6.32 18.75,6.7 18.76,6.69 RL.1 | v29.6,26.15 29.6,25.35 30.15,24.85 30.15,14.55 31.6,14.25 31.6,13.5 C6.1 31.65,13.35 31.65,10.65 31.41,10.4 31.5,10.65 30.6,10.65 | 30.6,10.65 29.78,11.47 v29.52,11.47 | 30.6,10.65 30.99,10.26 U$11.1 | v9.28,11.62 9.12,11.55 8.52,12.15 RS2.2 7.52,11.42 7.52,9.33 RS1.2 8.3,8.5 9.1,7.7 9.1,6.72 9.07,6.31 v9.25,6.3 | T1.P$5 7.21,3.15 7.55,3.39 v7.65,3.25 7.75,3.39 8.09,3.15 T1.P$2 | v10.6,24.45 11.65,24.45 | 11.65,24.45 11.65,23.55 11.7,23.5 U1.3 | 11.65,24.45 11.65,25.27 C12.1
  Bottom 0.25: C6.1 31.7,12.72 31.64,12.72 31.35,12.44 U$11.1 29.67,11.16 29.67,11.31 v29.52,11.47 | 15.58,11.25 16.01,11.68 16.72,11.68 17.79,12.74 17.79,13.48 | 18.53,14 | 18.53,14 18.53,13.89 18.12,13.48 17.79,13.48 | 17.79,13.48 U$1.P48 17.79,15.23 17.74,15.28 17.74,19.99 17.92,20.17 17.92,24.13 | 18.53,14 CP6.1 | 17.92,24.13 18,24.15 18.4,24.55 18.4,24.6 20,26.2 20.6,26.2 20.65,26.15 v29.6,26.15 | 7.39,5.77 U$1.P19 8.99,5.77 8.99,5.89 9.06,5.96 9.2,6.2 v9.25,6.3 9.14,6.38 8.98,6.62 8.85,6.75 8.2,6.75 U$1.P21 | U$1.P32 8.81,12.34 9.11,12.03 9.11,11.62 v9.28,11.62 9.41,11.74 9.9,11.25 13.73,11.25 13.78,11.2 14.75,11.2 14.8,11.25 15.58,11.25 | v7.65,3.25 7.58,3.09 7.2,3.25 6.55,3.25 5.7,4.1 5.7,5.05 6.4,5.75 CP5.1 6.53,5.77 7.39,5.77 | 7.39,5.77 7.39,5.26 U$1.P18 | 17.92,24.13 17.56,24.13 17.24,24.45 v10.6,24.45 | 15.58,11.25 15.38,11.04 15.38,8.87 15.89,8.36 16.25,8.36 18.31,6.3 18.7,6.42 v18.75,6.25 18.75,5.01 19,4.76 U$1.P64 19.89,4.67 CP4.1 | CP4.1 19.95,3.45 CP4.1
+5V  (via drill 0.3 pad 0.6)
  Top 0.25: C4.1 3.45,9.9 TP12.TP 1.26,10.19 | 2.45,11.9 2.48,11.88 v2.48,11.86 | 2.45,11.9 2.44,11.91 2.42,11.91 | C4.1 2.58,10.89 2.58,11.85 2.45,11.9 | TP24.TP 6.55,6.5 6.55,8.2 4.95,9.8 C5.1 4.88,9.88 C4.1 | v15.22,22.81 15.71,22.81 U1.1 16.4,23.55 16.6,23.75 16.6,25.4 C15.1 16.65,25.2 17.03,25.4 19.85,25.4 v20.1,25.45 20.2,25.5 20.45,25.75 24.05,25.75 24.65,25.75 D1.C
  Bottom 0.25: 20.46,25.73 29.19,25.73 C7.1 30.6,24.1 30.6,22.97 U$12.4 | 20.46,25.73 20.42,25.77 | v20.1,25.45 20.46,25.73 | v2.48,11.86 2.52,11.86 2.44,12.06 2.52,12.1 3.91,13.49 3.91,18.34 4.19,18.62 4.19,20.08 5.09,20.98 8.3,20.98 8.52,21.2 8.57,21.2 10.1,22.73 10.2,22.74 10.26,22.79 15.2,22.79 v15.22,22.81
CS_R  (via drill 0.3 pad 0.6)
  Top 0.15: v18.26,10.2 18.04,10.29 18.19,10.64 18.19,11.7 18.57,12.07 18.91,12.07 19.3,12.47 19.3,13.85 20.59,15.13 v20.59,15.25
  Bottom 0.15: U$5.5 19.7,20.2 19.7,17.52 20.59,16.63 v20.59,15.25 | U$1.P59 18.74,7.29 17.96,8.07 17.96,9.85 18.32,9.98 18.25,10.2 v18.26,10.2
DM  (via drill 0.3 pad 0.6)
  Top 0.15: R2.1 25.52,19.05 25.52,18.64 23.34,16.45 23.1,16.45 22.87,16.22 22.87,14.48 v23.08,14.27
  Bottom 0.15: v23.08,14.27 22.36,13.54 22.36,11.94 21.93,11.51 20.82,11.51 20.63,11.32 U$1.P51
DM_1
  Top 0.15: R2.2 27.65,19 27.65,19.3 28.55,19.3 U$4.P$2
DP  (via drill 0.3 pad 0.6)
  Top 0.15: R1.1 24.85,20.25 24.2,19.6 24.2,18.95 22.15,16.9 22.15,15.92 21.04,14.81 20.88,14.81 19.6,13.53 19.6,12.29 18.82,11.51 v18.75,11.51
  Bottom 0.15: U$1.P50 19.05,11.83 18.96,11.46 v18.75,11.51
DP_1
  Top 0.15: R1.2 27.6,20.1 28.8,20.1 U$4.P$3
GND  (via drill 0.3 pad 0.6)
  other vias: 21.39,13.58 25.84,11.35 29.45,9.7 22.99,8.61 5.18,5.47 7.62,4.07 7.67,2.17 11.02,5.67 11.57,6.97 13.77,18.52 9.33,23.82 10.73,23.57 23.32,25.11 27.77,24.46 18.43,18.41 9.58,8.16 9.78,5.71 9.33,5.16 23.53,21.32 21.68,21.32 25.23,24.47 7.99,1.41 7.84,20.31 16.91,10.65 18.98,22.77 18.56,26.25 19.78,23.52 20.54,17.5 19.92,16.5 16.25,9.23 9.83,4.61 15.81,5.53 24.73,19.36 6.94,10.21 11.29,12.12 18.48,12.9 5.18,13.32 23.58,19.15 21.68,23.17 27.08,24.37 31.33,25.37 12.78,23.82 5.95,25.97 3.83,25.07 16.43,19.02 14.63,19.02 12.73,5.56 13.41,7.11 11.65,5.2 11.76,3.79 10.43,0.68 18.22,3.68 8.14,18.56 22.65,22.24 18.87,16.43 13.95,26.4 12.44,26.23 10.25,25.74 19.37,24.45 30.54,26.14 10.09,16.01 5.33,7.21 12.85,21.49 14.86,22.11 13.2,19.75 17.1,17.35 16.2,16.65 10.92,18.98 11.82,19 10.79,21.44 11.93,21.37 17.33,21.99 19.1,21.41 18.33,19.73 17.34,22.92 19.24,15.57 23.58,23.2 20.3,24.6 31.72,26.01 17.79,24.79 8.06,25.95 1.17,25.81 7.55,24 5.9,21.6 4.56,13.54 5.89,10.74 6.25,11.95 2.3,9.3 2.47,1.95 17.2,5.19 16.13,4.37 17.46,3.97 10.97,10.67 18.4,1.65 3.61,1.06 11.37,9.95 18.46,15.41 20.28,18.85 10.85,8.1 12.35,6.6 14.36,6.8 4.63,4.83 16.38,10.11 22.7,18.41 5.14,2.03 9.68,1.41 6.45,1.42 29.4,12.3 27.69,17 24.54,24.05 28.44,12.55 27.69,15.75 23.76,8.84 25.79,7.6 26.59,7.6 25.84,6.9 26.69,6.9 23.69,7 24.04,4.65 25.54,4.65 22.86,2.1 25.21,0.7 27.96,1.3 29.41,1 20.36,2 14.06,5.73 12.16,4.53 29.34,2.43 31.29,0.88 29.04,14.43 20.61,20.08 15.48,21.53 24.03,3.68 25.54,3.65 25.83,12.42 25.83,13.42
  pour Bottom: 0,25 arc-90 2,27 31,27 arc-90 33,25 33,2 arc-90 31,0 2,0 arc-90 0,2
  pour Top: 2,27 arc90 0,25 0,2 arc90 2,0 31,0 arc90 33,2 33,25 arc90 31,27
INT_A  (via drill 0.3 pad 0.6)
  Top 0.15: v12.74,3.8 13.34,4.4 13.98,4.58 15.59,4.58 16.01,5 16.03,5 16.6,5.57 16.6,5.88 17.33,6.61 17.33,8.28 18.42,9.37 18.66,9.37 19.22,9.93 v21.02,9.93
  Bottom 0.15: v21.02,9.93 21.34,10.25 21.97,10.25 22.25,10.53 22.25,11.39 22.66,11.8 22.66,12.58 23.73,13.65 U$7.5 | U$1.P11 12.73,3.49 12.87,3.7 12.72,3.79 v12.74,3.8
INT_R  (via drill 0.3 pad 0.6)
  Top 0.15: v16.4,6.43 16.31,6.75 17.01,7.45 17.01,8.39 18.3,9.67 18.48,9.67 20.43,11.62 v20.43,12.92
  Bottom 0.15: v20.43,12.92 20.78,13.28 20.78,13.74 20.06,14.46 20.06,15.56 19.4,16.22 19.4,20.85 20.16,21.61 20.16,21.9 U$5.6 | U$1.P24 8.94,8.29 9.02,8.37 9.02,9.26 9.32,9.57 9.76,9.57 10.25,9.07 13.35,9.07 16.05,6.37 16.26,6.43 v16.4,6.43
LED1  (via drill 0.3 pad 0.6)
  Top 0.15: LED1.A 12.88,11.52 12.88,12.14 15.93,15.19 16.35,15.19 v16.41,15.41
  Bottom 0.15: v16.41,15.41 16.36,15.29 16.2,15.36 15.95,15.11 15.77,15.11 U$1.P44
MISO  (via drill 0.3 pad 0.6)
  Top 0.15: v17.08,16.38 17.15,16.38 19.47,18.69 19.47,18.84 20.03,19.41 21.25,19.41 v21.33,19.32
  Bottom 0.15: v21.33,19.32 21.66,19.64 U$5.4 | U$1.P41 14.25,15.11 14.6,15.46 15.74,15.46 15.88,15.6 15.88,15.62 16.19,15.93 16.22,15.93 16.75,15.93 16.98,16.34 17.04,16.34 v17.08,16.38
MOSI  (via drill 0.3 pad 0.6)
  Top 0.15: v22.08,19.28 21.13,18.33 19.61,18.33 17.62,16.34 17.62,15.8 15.94,14.13 15.61,14.13 15.13,13.64 15.13,13.62 14.8,13.53 14.86,13.3 v14.84,13.3
  Bottom 0.15: v22.08,19.28 22.3,19.51 U$5.3 | U$1.P42 14.76,13.61 14.66,13.39 14.86,13.3 v14.84,13.3
N$1
  Top 0.15: RL1.2 LED1.C
N$2  (via drill 0.3 pad 0.6)
  Top 0.15: v21.1,2.94 21.1,3.75 v20.76,4.09
  Bottom 0.15: U$1.P63 20.63,5.26 20.63,4.22 v20.76,4.09 | RST.TP 21.85,1 21.1,1.75 v21.1,2.94
N$3
  Bottom 0.15: CA3.1 27.93,10.3 27.77,10.45 U$7.13
N$4
  Top 0.15: RL2.2 LED2.C
N$5
  Top 0.15: RL3.2 LED3.C
N$6  (via drill 0.3 pad 0.6)
  Top 0.15: LED2.A | LED2.A 14.2,11.52 15.15,12.48 15.2,12.48 15.81,13.08 15.95,13.11 v15.95,13.3
  Bottom 0.15: v15.95,13.3 16.13,13.48 16.13,13.49 16.25,13.61 16.27,13.61 U$1.P45
N$7  (via drill 0.3 pad 0.6)
  Top 0.15: LED3.A 15.35,12.14 15.56,12.14 16.71,13.3 v16.84,13.3
  Bottom 0.15: v16.84,13.3 17.04,13.3 16.81,13.35 16.81,13.52 16.77,13.56 16.77,13.61 U$1.P46
N$8
  Bottom 0.15: U$5.14 25.07,22.55 CR2.2
N$10
  Bottom 0.15: CA2.1 24.5,15.53 24.37,15.53 23.65,14.8 23.65,14.52 23.73,14.45 U$7.6
N$11
  Bottom 0.15: U$7.12 28.25,11.25 CA3.2
N$12
  Bottom 0.15: TP15.TP 1.05,4.35 1.5,4.35 3,5.85 3,6.3 R3.2
N$13
  Top 0.25: TP14.TP 1.05,4.35 2.7,4.35 3.15,4.8 3.45,4.8 C13.1 | 5.7,4.15 5.7,2.7 6.2,2.2 T1.P$6 | C13.1 3.7,4.65 4.2,4.15 5.7,4.15 | 5.7,4.15 6.45,4.15 T1.P$4 | C13.1 3.45,4.88 3.45,6.35 C14.1
N$14
  Bottom 0.15: TP16.TP 1.05,2.4 1.65,2.4 2.4,3.15 3,3.15 R6.2
N$15
  Top 0.15: R7.2 3.3,8.1 2.55,8.1 1.65,7.2 1.05,7.2 TP17.TP 1.26,7.4
N$16
  Bottom 0.15: R8.2 3,8.1 2.25,8.1 1.35,7.2 1.05,7.2 TP18.TP 1.26,7.4
N$18  (via drill 0.3 pad 0.6)
  Top 0.15: 7.52,14.33 7.62,14.23 7.96,14.23 8.66,14.1 OK1.1 | TP23.TP 5.97,14.23 6.07,14.33 7.52,14.33 | 7.52,14.33 7.51,14.34 v7.33,14.34
  Bottom 0.15: v7.33,14.34 6.86,14.8 R11.2
N$19  (via drill 0.3 pad 0.6)
  Top 0.15: 7.64,17.23 8.07,17.23 8.66,16.64 OK1.3 | TP22.TP 6.97,17.9 7.64,17.23 | 7.64,17.23 7.53,17.23 v7.51,17.25
  Bottom 0.15: v7.51,17.25 7.46,17.2 R13.2
N$22  (via drill 0.3 pad 0.6)
  Top 0.15: v8.02,19.45 8.23,19.54 8.38,19.18 OK1.5 | TP21.TP 4.5,20.35 5.53,19.32 5.63,18.94 v5.85,19
  Bottom 0.15: 6.67,19.82 7.05,19.45 7.57,19.45 7.91,19.25 v8.02,19.45 | v5.85,19 5.79,19.22 6.17,19.32 6.67,19.82 | 6.67,19.82 6.7,19.85 R15.2
N$23
  Bottom 0.15: R4.1 29.1,19.35 29.1,19.85 29.7,20.45 31.2,20.45 31.3,20.55 U$12.3
N$25
  Bottom 0.15: R5.1 31.3,18 U$12.2
N$26  (via drill 0.3 pad 0.6)
  Top 0.15: v7.88,22.02 8.18,21.72 OK1.7 | TP20.TP 5.02,23.51 v6.21,23.51
  Bottom 0.15: v7.88,22.02 7.17,22.02 6.91,22.28 R17.2 6.35,22.84 6.35,23.24 5.89,23.51 v6.21,23.51
N$30  (via drill 0.3 pad 0.6)
  Top 0.15: 7.53,25.74 7.42,25.84 7.18,26.15 v7,26.01 | 7.53,25.74 8.66,24.61 8.66,24.56 OK3.1 | TP19.TP 5.11,25.44 7.23,25.44 7.53,25.74
  Bottom 0.15: v7,26.01 7.2,25.9 7,25.56 7,25.51 R19.2
PWM1
  Bottom 0.15: R9.1 5.03,11.32 U$1.P30
PWM2
  Bottom 0.15: R11.1 5.2,14.21 7.44,11.97 7.44,11.83 U$1.P31
PWM3  (via drill 0.3 pad 0.6)
  Top 0.15: v7.3,15.7 7.49,15.51 v8.35,15.51
  Bottom 0.15: v8.35,15.51 8.35,15.59 9.18,15.11 10.21,15.11 U$1.P33 | R13.1 5,16.95 5.57,16.39 5.58,16.32 5.89,16.32 6.44,15.77 7.11,15.77 7.18,15.7 v7.3,15.7
PWM4  (via drill 0.3 pad 0.6)
  Top 0.15: v16.45,12.25 16.45,12.02 16.09,11.22 v16.29,11.1
  Bottom 0.15: v16.29,11.1 16.34,10.92 15.73,10.3 15.73,9.02 16.04,8.71 16.39,8.71 18.32,6.78 U$1.P60 | R15.1 5,18.94 4.6,18.54 4.6,16.6 5.85,15.35 5.85,13.98 6.82,13.02 8.62,13.02 10.04,11.6 13.88,11.6 13.93,11.55 14.61,11.55 15.31,12.25 v16.45,12.25
PWM5  (via drill 0.3 pad 0.6)
  Top 0.15: v10.85,16.05 10.68,15.99 10.53,16.37 10.05,16.85 10.05,22.05 9.9,22.2 8.59,22.2 v7.91,22.88
  Bottom 0.15: U$1.P36 11.72,15.11 11.52,15.11 11,15.63 11.07,16.01 v10.85,16.05 | v7.91,22.88 7.49,23.29 7.42,23.29 6.68,24.03 5.88,24.03 5.37,23.52 5.37,23.39 5.06,23.08 R17.1
PWM6  (via drill 0.3 pad 0.6)
  Top 0.15: v10,6.65 9.85,6.82 10.15,7.07 10.15,12.66 v9.89,12.92 | v6.9,18.9 6.71,19.01 6.71,19.71 4.96,21.45 v4.5,21.45
  Bottom 0.15: v10,6.65 10.21,6.71 10.31,6.33 10.36,6.29 10.36,4.23 10.14,4.02 10.14,3.56 10.21,3.49 U$1.P16 | v4.5,21.45 4.5,24.3 R19.1 | v9.89,12.92 7.83,14.99 7.83,16.82 8.03,17.03 8.03,17.84 7.25,18.62 7.11,18.98 v6.9,18.9
RC1-RX1
  Bottom 0.15: R3.1 4.4,7.07 5.15,7.82 5.15,8.09 5.89,8.82 7.42,8.82 7.44,8.8 U$1.P25
RC2
  Bottom 0.15: R6.1 4.4,1.96 5.5,0.86 9.87,0.86 10.92,1.91 12.15,1.91 12.23,1.99 U$1.P12
RC3  (via drill 0.3 pad 0.6)
  Top 0.15: R7.1 4.7,8.74 4.86,9.09 v4.66,9.19 | v5.84,12.82 6.78,13.76 v6.81,13.76
  Bottom 0.15: v6.81,13.76 7.3,13.76 8.03,13.34 8.73,13.34 9.67,12.39 10.11,12.39 10.59,12.87 10.59,13.48 10.71,13.61 U$1.P34 | v4.66,9.19 4.44,9.13 4.34,9.5 3.76,10.08 3.76,11.41 5.15,12.79 5.81,12.79 v5.84,12.82
RC4  (via drill 0.3 pad 0.6)
  Top 0.15: v6.88,9.36 6.66,9.3 6.56,9.68 6.42,9.82 6.42,10.71 7.14,11.43 7.14,12.16 8.43,13.45 10.76,13.45 v11.22,12.98
  Bottom 0.15: R8.1 4.41,8.2 5.38,9.16 6.77,9.16 v6.88,9.36 | v11.22,12.98 12.3,11.91 13.99,11.91 14.05,11.85 14.48,11.85 15.41,12.78 17.05,12.78 17.36,13.08 17.36,14.27 U$1.P47
RX_SW  (via drill 0.3 pad 0.6)
  Top 0.15: 9.65,3.9 10.31,3.9 10.48,3.74 | 10.48,3.74 | 10.48,3.74 10.53,3.79 v10.66,3.79 v10.67,3.8 | T1.P$1 9.1,2.2 9.65,2.75 9.65,3.9 | 9.65,3.9 9.1,3.9 T1.P$3
  Bottom 0.15: v10.67,3.8 10.71,3.76 U$1.P15
S1S
  Bottom 0.15: R9.2 3,10.8 2.25,10.8 1.35,9.9 TP11.TP 1.05,10.1
S2+
  Top 0.15: TP10.TP 1.05,12.6 1.65,12.6 2.7,13.65 2.7,14.1 OK1.16
S2S  (via drill 0.3 pad 0.6)
  Top 0.15: v1.5,13.95 2.7,15.15 2.7,15.3 OK1.15
  Bottom 0.15: TP9.TP 1.05,12.75 1.5,13.2 v1.5,13.95
S3+
  Top 0.15: TP8.TP 1.05,15.45 1.05,15.75 1.95,16.65 2.7,16.65 OK1.14
S3S  (via drill 0.3 pad 0.6)
  Top 0.15: v1.35,16.8 1.65,16.8 1.8,16.95 1.95,16.95 2.7,17.7 2.7,17.85 OK1.13
  Bottom 0.15: TP7.TP 1.05,15.3 1.35,15.6 v1.35,16.8
S4+
  Top 0.15: TP6.TP 0.9,18.15 1.95,19.2 2.7,19.2 OK1.12
S4S  (via drill 0.3 pad 0.6)
  Top 0.15: v1.5,19.5 1.95,19.5 2.7,20.25 2.7,20.4 OK1.11
  Bottom 0.15: TP5.TP 1.05,18.15 1.5,18.6 v1.5,19.5
S5+
  Top 0.15: TP4.TP 1.05,20.85 1.95,21.75 2.7,21.75 OK1.10
S5S  (via drill 0.3 pad 0.6)
  Top 0.15: v1.95,22.35 2.55,22.95 2.7,22.95 OK1.9
  Bottom 0.15: TP3.TP 1.05,21 1.05,21.45 v1.95,22.35
S6+
  Top 0.15: TP2.TP 0.9,23.7 1.8,24.6 2.7,24.6 OK3.4
S6S  (via drill 0.3 pad 0.6)
  Top 0.15: v1.95,25.2 2.55,25.8 2.7,25.8 OK3.3
  Bottom 0.15: TP1.TP 1.05,23.7 1.05,24.3 v1.95,25.2
SCK  (via drill 0.3 pad 0.6)
  Top 0.15: v22.83,19.42 22.83,19.29 21.57,18.03 19.73,18.03 17.92,16.22 17.92,15.64 16.11,13.82 15.74,13.82 15.43,13.52 15.43,13.13 15.08,12.78 14.67,12.78 v14.27,12.37
  Bottom 0.15: v22.83,19.42 22.95,19.54 U$5.2 | U$1.P35 11.22,13.61 11.41,13.61 12.25,12.77 12.59,12.77 12.61,12.76 13.54,12.76 | 13.54,12.76 | 13.54,12.76 | 13.54,12.76 13.7,12.76 13.7,12.75 13.83,12.75 13.98,12.6 14.01,12.6 14.02,12.58 14.04,12.58 14.04,12.57 14.06,12.57 14.07,12.56 v14.27,12.37
SCL  (via drill 0.3 pad 0.6)
  Top 0.15: RS1.1 8.85,9.9 9.23,9.89 v9.24,10.12
  Bottom 0.15: U$7.2 22.95,11.25 22.85,11.15 22.85,10.28 22.2,9.63 21.99,9.63 21.48,9.13 21.48,8.69 21.79,8.38 22.26,8.38 22.97,7.68 22.97,7.24 22.38,6.65 22.01,6.65 21.68,6.32 21.68,6.31 20.96,5.59 20.96,4.99 21.4,4.56 | 21.4,4.56 U$9.6 | 21.4,4.56 21.4,3.98 20.07,2.65 19.85,2.65 18.75,3.75 18.75,4.08 18.62,4.57 17.94,5.25 17.94,6.17 16.12,7.99 15.74,7.99 14.36,9.37 10.38,9.37 9.69,10.06 9.33,9.91 v9.24,10.12 9.12,10.04 8.94,10.31 U$1.P28
SDA  (via drill 0.3 pad 0.6)
  Top 0.15: 18.78,8.98 19.15,9.36 20.68,9.36 v20.86,9.18 | RS2.1 8.85,10.85 9.11,11.05 v9.25,10.87 9.46,10.94 9.59,10.57 9.77,10.39 9.77,9.43 9.43,9.24 v9.54,9.04 | v17.4,5.94 17.63,6.17 17.63,8.15 18.46,8.98 18.78,8.98 | 18.78,8.98 19.02,8.74 19.02,8.05 18.23,7.26 18.23,6.03 19.06,5.21 v21.5,5.21
  Bottom 0.15: v20.86,9.18 21.1,9.18 21.86,9.94 22.08,9.94 22.55,10.41 22.55,11.27 23.33,12.05 23.73,12.05 U$7.3 | v9.54,9.04 9.75,9.13 9.9,8.77 13.13,8.77 15.86,6.05 16.03,6.05 16.2,5.89 16.96,5.89 17.32,5.74 v17.4,5.94 | v9.25,10.87 9.18,10.71 8.94,10.82 U$1.P29 | v21.5,5.21 21.68,5.39 21.68,5.83 U$9.7
TCA0  (via drill 0.3 pad 0.6)
  Top 0.15: v21.5,16.59 20.75,16.59 19.76,15.6 19.76,15.22 17.43,12.89 17.43,9.65 16.19,8.42 16.19,7.56 v14.87,6.24
  Bottom 0.15: v21.5,16.59 22.7,17.79 24.65,17.79 25.2,18.33 26.13,18.4 26.84,18.4 R4.2 | U$1.P6 15.26,3.49 15.29,3.52 15.29,5.83 v14.87,6.24
TCB0  (via drill 0.3 pad 0.6)
  Top 0.15: v21.33,15.84 20.43,15.84 20.06,15.47 20.06,15.09 19,14.03 19,12.63 18.75,12.38 18.45,12.38 17.73,11.66 17.73,9.53 16.68,8.48 16.68,7.6 15.4,6.32 15.4,5.94 14.76,5.3 v14.76,5.1
  Bottom 0.15: v21.33,15.84 21.5,15.84 23.15,17.49 26.71,17.49 27.21,17.99 R5.2 | U$1.P7 v14.76,5.09 v14.76,5.1
TCK
  Bottom 0.15: U$1.P2 17.28,1.99 18.3,0.97 TCK.TP
TDI
  Bottom 0.15: TDI.TP U$1.P3
TDO
  Bottom 0.15: TDO.TP 15.26,0.97 16.27,1.99 U$1.P4
TMS
  Bottom 0.15: TMS.TP 12.57,1.85 15.63,1.85 15.77,1.99 U$1.P5
UART0_RX  (via drill 0.3 pad 0.6)
  Top 0.15: U$11.3 31.3,5.2 29.73,6.77 29.26,6.77 28.67,7.36 27.89,7.36 26.9,6.36 25.59,6.36 23.92,8.03 v21.18,8.03
  Bottom 0.15: U$1.P57 20.91,8.29 v21.18,8.03
UART0_TX  (via drill 0.3 pad 0.6)
  Top 0.15: v28.91,6.31 28.32,5.72 23.32,5.72 21.69,7.34 v21.69,7.48 | v29.47,7.29 29.9,7.72 U$11.2
  Bottom 0.15: U$1.P58 20.63,7.79 20.95,7.48 v21.69,7.48 | v28.91,6.31 29.47,6.87 v29.47,7.29
UART2_RX  (via drill 0.3 pad 0.6)
  Top 0.15: v21.16,6.53 22.32,5.36 29.02,5.36 v29.5,5.84
  Bottom 0.15: U$10.2 29.72,6.08 29.72,6.06 v29.5,5.84 | U$1.P62 20.63,5.77 20.63,6 v21.16,6.53
UART2_TX  (via drill 0.3 pad 0.6)
  Top 0.15: v28.34,6.8 27.6,6.06 23.84,6.06 v22.44,7.46
  Bottom 0.15: U$1.P61 20.37,6.28 20.63,6.54 20.63,6.76 20.93,7.05 21.37,7.05 21.47,6.95 21.93,6.95 v22.44,7.46 | v28.34,6.8 28.34,6.91 29.32,7.88 31.18,7.88 U$10.3
VBUS  (via drill 0.3 pad 0.6)
  Top 0.15: v21.92,14.94 21.49,14.51 21.01,14.51 19.9,13.4 19.9,11.89 18.99,10.98 18.81,10.98 v18.75,10.76 | v23.4,15.9 23.55,15.95 23.55,16.2 25.7,18.35 26.8,18.35 | 26.8,18.35 27.95,18.35 U$4.P$1 | v23.4,15.9 23.57,15.73 23.57,15.68 | v23.4,15.9 23.6,15.7 24.5,15.7 CU1.1 | 26.8,18.35 26.75,18.4 26.75,20.8 26.55,21.25 26.55,24.2 26.55,24.35 26.55,24.6 D1.A
  Bottom 0.15: v21.92,14.94 22.88,15.9 v23.4,15.9 | U$1.P52 19.05,10.82 18.82,10.92 v18.75,10.76
VCCSENS  (via drill 0.3 pad 0.6)
  Top 0.25: v24.43,18.31 22.52,16.4 22.52,14.72 21.96,14.16 21.15,14.16 20.82,13.82 20.82,13.35 21.21,12.95 21.21,10.77 21.71,10.27 21.71,9.21 | v22,8.91 21.71,9.21 | 21.71,9.21 21.1,8.6 20.68,8.6 RL.2
  Bottom 0.25: CA1.1 24.95,9.38 25.52,9.95 25.52,10.2 | 25.52,10.2 25.52,10.45 U$7.1 23.68,10.45 22.13,8.91 v22,8.91 | 25.52,10.2 U$7.14 26.54,9.52 27.32,9.52 CA4.1 27.32,7.01 28.6,5.73 28.77,5.73 29.38,5.12 29.38,4.16 29.2,3.98 28.65,3.98 CPR.1 28.65,2.73 28.02,2.73 27.71,2.41 | 23.78,20.35 23.78,20.41 24.57,21.2 | v24.43,18.31 24.16,18.59 24.16,19.97 23.78,20.35 | 23.78,20.35 U$5.1 | 24.57,21.2 24.57,21.23 | 24.57,21.23 | 24.57,21.23 U$5.16 | 24.57,21.2 24.7,21.2 | 24.7,21.2 24.87,21.37 24.87,21.78 | 24.7,21.2 25.02,20.88 25.02,20.8 CR3.1 | 24.87,21.78 24.75,21.9 U$5.15 | 24.87,21.78 25.25,22.15 CR1.1 | U$9.4 24.81,1.46 27.2,1.46 27.71,1.97 27.71,2.41 | 27.71,2.41 27.71,3.17 27.59,3.29 U$9.3
XTAL1
  Bottom 0.15: Q1.3 11.38,20.2 12.95,18.62 CQ2.2 13.24,15.86 U$1.P39
XTAL2
  Bottom 0.15: Q1.1 15.66,17.8 CQ1.2 13.74,15.88 U$1.P40

### Text on the board
tRestrict: FCM2.2 | huslik.net
tDocu: (c) Fabian Huslik, 2012-2014 | This work is licensed under the Creative Commons Attribution-ShareAlike 4.0 International License. | To view a copy of this license, visit http://creativecommons.org/licenses/by-sa/4.0/. | PWM out | 5V | RC in | 5V for Receiver
bDocu: 3V3 | GND